# Altium schematic sheet Motor Drivers.SchDoc: Dual Feeder - Motor Drivers
size Letter; DrawnBy: Mark Harris; Engineer: Mark Harris; Organization: Mark Harris; ProjectName: Dual Feeder Controller
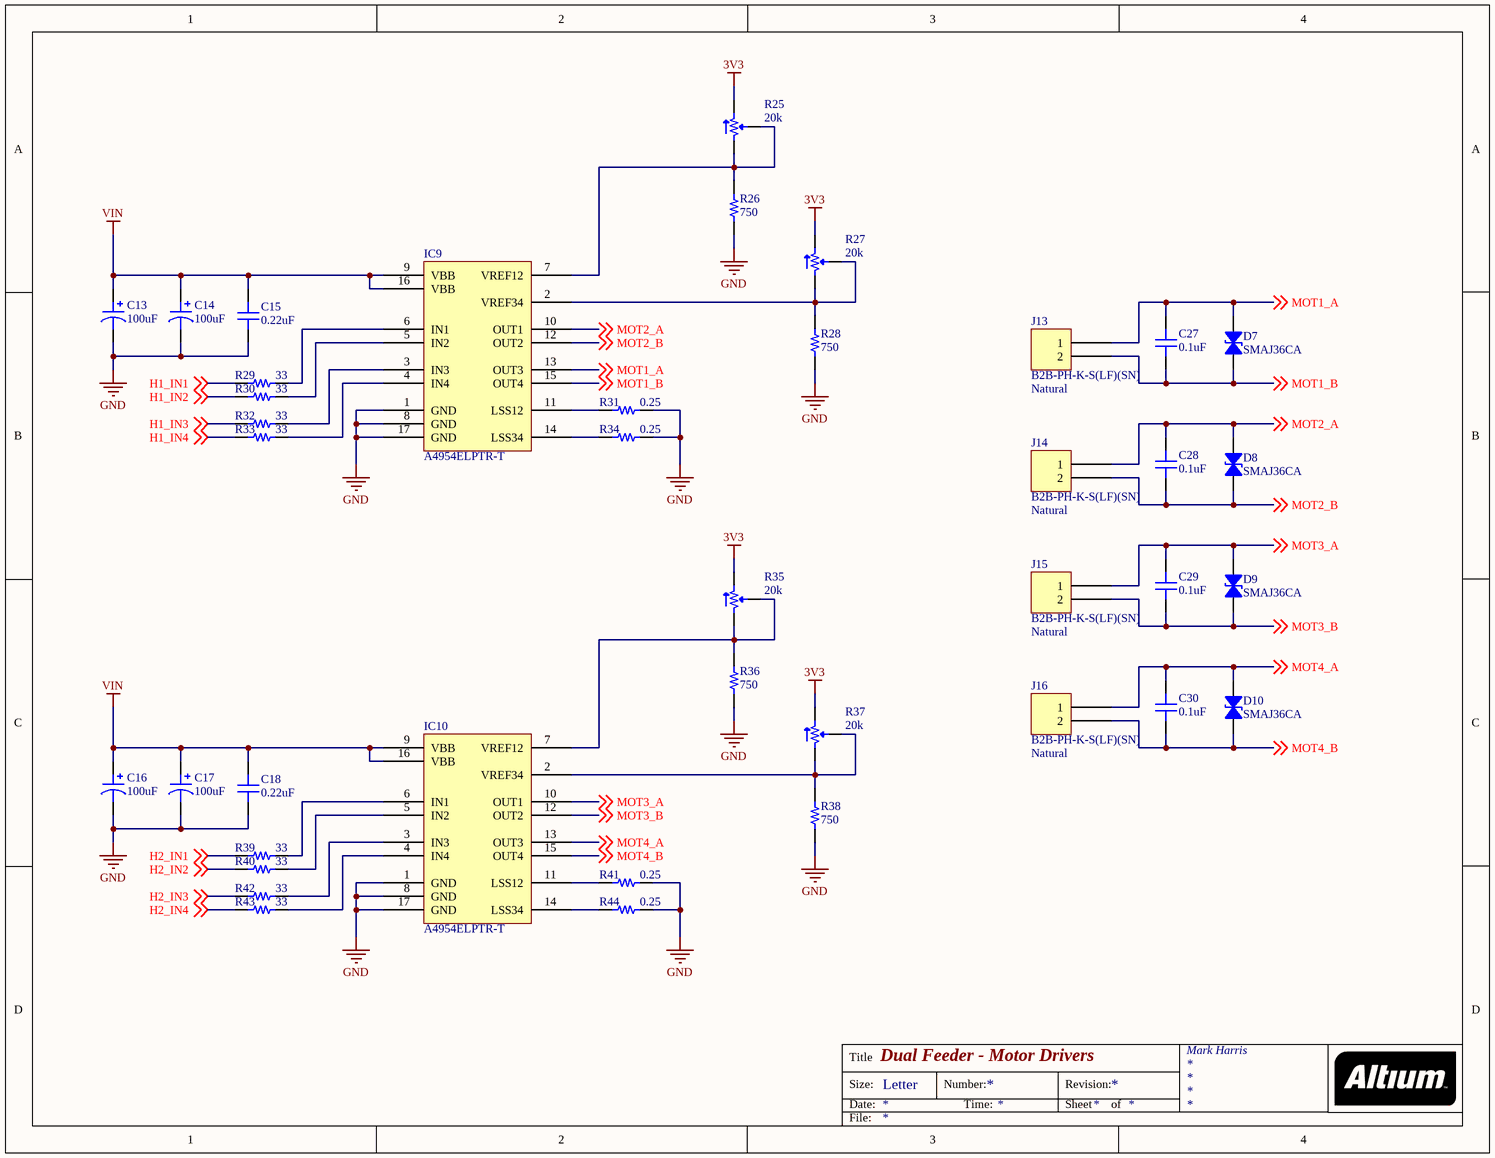
[diagram p0: Motor Drivers.SchDoc]

## Parts
C13  100uF  [CAP ALUM 8.3MM]
C14  100uF  [CAP ALUM 8.3MM]
C15  0.22uF  [CAP 0805/2012]
C16  100uF  [CAP ALUM 8.3MM]
C17  100uF  [CAP ALUM 8.3MM]
C18  0.22uF  [CAP 0805/2012]
C27  0.1uF  [CAP 0603/1608]
C28  0.1uF  [CAP 0603/1608]
C29  0.1uF  [CAP 0603/1608]
C30  0.1uF  [CAP 0603/1608]
D7  SMAJ36CA  [Bourns DO214AC SMA]
D8  SMAJ36CA  [Bourns DO214AC SMA]
D9  SMAJ36CA  [Bourns DO214AC SMA]
D10  SMAJ36CA  [Bourns DO214AC SMA]
IC9  A4954ELPTR-T  [ALLEGRO TSSOP-16EP LP]
IC10  A4954ELPTR-T  [ALLEGRO TSSOP-16EP LP]
J13  B2B-PH-K-S(LF)(SN)  Colour: Natural  [JST B2B-PH-K]
J14  B2B-PH-K-S(LF)(SN)  Colour: Natural  [JST B2B-PH-K]
J15  B2B-PH-K-S(LF)(SN)  Colour: Natural  [JST B2B-PH-K]
J16  B2B-PH-K-S(LF)(SN)  Colour: Natural  [JST B2B-PH-K]
R25  20k  [POT BOURNS TRIMPOT 3302]
R26  750  [RES 0603/1608]
R27  20k  [POT BOURNS TRIMPOT 3302]
R28  750  [RES 0603/1608]
R29  33  [RES 0603/1608]
R30  33  [RES 0603/1608]
R31  0.25  [STACKPOLE CSR1206]
R32  33  [RES 0603/1608]
R33  33  [RES 0603/1608]
R34  0.25  [STACKPOLE CSR1206]
R35  20k  [POT BOURNS TRIMPOT 3302]
R36  750  [RES 0603/1608]
R37  20k  [POT BOURNS TRIMPOT 3302]
R38  750  [RES 0603/1608]
R39  33  [RES 0603/1608]
R40  33  [RES 0603/1608]
R41  0.25  [STACKPOLE CSR1206]
R42  33  [RES 0603/1608]
R43  33  [RES 0603/1608]
R44  0.25  [STACKPOLE CSR1206]

## Nets
3V3: R25.3 R27.3 R35.3 R37.3
GND: C13.2 C14.2 C15.1 C16.2 C17.2 C18.1 IC9.1(GND) IC9.8(GND) IC9.17(GND) IC10.1(GND) IC10.8(GND) IC10.17(GND) R26.1 R28.1 R31.2 R34.2 R36.1 R38.1 R41.2 R44.2
VIN: C13.1 C14.1 C15.2 C16.1 C17.1 C18.2 IC9.9(VBB) IC9.16(VBB) IC10.9(VBB) IC10.16(VBB)
H1_IN1: R29.1 ; off-sheet H1_IN1
H1_IN2: R30.1 ; off-sheet H1_IN2
H1_IN3: R32.1 ; off-sheet H1_IN3
H1_IN4: R33.1 ; off-sheet H1_IN4
H2_IN1: R39.1 ; off-sheet H2_IN1
H2_IN2: R40.1 ; off-sheet H2_IN2
H2_IN3: R42.1 ; off-sheet H2_IN3
H2_IN4: R43.1 ; off-sheet H2_IN4
MOT1_A: C27.1 D7.2 IC9.13(OUT3) J13.1 ; off-sheet MOT1_A
MOT1_B: C27.2 D7.1 IC9.15(OUT4) J13.2 ; off-sheet MOT1_B
MOT2_A: C28.1 D8.2 IC9.10(OUT1) J14.1 ; off-sheet MOT2_A
MOT2_B: C28.2 D8.1 IC9.12(OUT2) J14.2 ; off-sheet MOT2_B
MOT3_A: C29.1 D9.2 IC10.10(OUT1) J15.1 ; off-sheet MOT3_A
MOT3_B: C29.2 D9.1 IC10.12(OUT2) J15.2 ; off-sheet MOT3_B
MOT4_A: C30.1 D10.2 IC10.13(OUT3) J16.1 ; off-sheet MOT4_A
MOT4_B: C30.2 D10.1 IC10.15(OUT4) J16.2 ; off-sheet MOT4_B
NetIC9_2: IC9.2(VREF34) R27.1 R27.2 R28.2
NetIC9_3: IC9.3(IN3) R32.2
NetIC9_4: IC9.4(IN4) R33.2
NetIC9_5: IC9.5(IN2) R30.2
NetIC9_6: IC9.6(IN1) R29.2
NetIC9_7: IC9.7(VREF12) R25.1 R25.2 R26.2
NetIC9_11: IC9.11(LSS12) R31.1
NetIC9_14: IC9.14(LSS34) R34.1
NetIC10_2: IC10.2(VREF34) R37.1 R37.2 R38.2
NetIC10_3: IC10.3(IN3) R42.2
NetIC10_4: IC10.4(IN4) R43.2
NetIC10_5: IC10.5(IN2) R40.2
NetIC10_6: IC10.6(IN1) R39.2
NetIC10_7: IC10.7(VREF12) R35.1 R35.2 R36.2
NetIC10_11: IC10.11(LSS12) R41.1
NetIC10_14: IC10.14(LSS34) R44.1

## Notes on the sheet
- Title
- Size:
- Date:
- Letter
- Number:
- Time:
- Revision:
- Sheet
- of
- File:

## Library data of the parts
C13 C14 C16 C17 = UWT1H101MNL1GS: CAP ALUM 100UF 20% 50V SMD; Manufacturer: Nichicon; TemperatureRange: -55C ~ 105C; Type: General Purpose; Ripple Current: 140mA; Lifetime @ Temp: 1000 Hrs @ 105C; Value: 100uF; Part Number: UWT1H101MNL1GS; PartId: 7285; Supplier 1: Digi-Key; Supplier Part Number 1: 493-2226-2-ND; ComponentLink1Description: Datasheet; ComponentLink1URL: http://nichicon-us.com/english/products/pdfs/e-wt.pdf; ComponentLink2Description: Digi-Key listing; ComponentLink2URL: http://digikey.com/product-detail/en/UWT1H101MNL1GS/493-2226-2-ND/589967; Tolerance: 20%; Voltage: 50V; Price: 0.2178; Device Package: Radial, Can - SMD; Impedance: -
C15 C18 = CL21B224KBFSFNE: CAP CER 0.22UF 50V X7R 0805; Manufacturer: Samsung Electro-Mechanics America, Inc.; TemperatureRange: -55C ~ 125C; Tolerance: 10%; Value: 0.22uF; Part Number: CL21B224KBFSFNE; PartId: 13765; Supplier 1: Digi-Key; Supplier Part Number 1: 1276-2948-2-ND; ComponentLink1Description: Datasheet; ComponentLink1URL: //media.digikey.com/pdf/Data%20Sheets/Samsung%20PDFs/CL21B224KBFSFNE_Spec.pdf; ComponentLink2Description: Digi-Key Listing; ComponentLink2URL: https://www.digikey.com/product-detail/en/samsung-electro-mechanics-america-inc/CL21B224KBFSFNE/1276-2948-2-ND/3888606; TemperatureCoefficient: X7R; Voltage: 50V; Price: 0.0195; Device Package: 0805 (2012 Metric)
C27-C30 = CL10B104JB8NNNC: CAP CER 0.1UF 50V X7R 0603; Manufacturer: Samsung Electro-Mechanics America, Inc.; TemperatureRange: -55C ~ 125C; Tolerance: 5%; Value: 0.1uF; Part Number: CL10B104JB8NNNC; PartId: 5416; Supplier 1: Digi-Key; Supplier Part Number 1: 1276-1033-2-ND; ComponentLink1Description: Datasheet; ComponentLink1URL: http://www.samsungsem.com/kr/support/product-search/mlcc/CL10B104JB8NNNC.jsp; ComponentLink2Description: Digi-Key listing; ComponentLink2URL: http://digikey.com/product-detail/en/CL10B104JB8NNNC/1276-1033-2-ND/3886691; TemperatureCoefficient: X7R; Voltage: 50V; Price: 0.0132; Type: -; Device Package: 0603 (1608 Metric)
D7-D10 = SMAJ36CA: TVS DIODE 36VWM 58.1VC DO214AC; Manufacturer: Bourns Inc.; Type: Zener; Bidirectional Channels: 1; Power - Peak Pulse: 400W; Current - Peak Pulse: 6.9A; Voltage (Clamping): 58.1V; Voltage (Breakdown): 40V; Voltage (Reverse Standoff): 36V; Part Number: SMAJ36CA; PartId: 14838; Supplier 1: Digi-Key; Supplier Part Number 1: SMAJ36CABTR-ND; ComponentLink1Description: Datasheet; ComponentLink1URL: http://www.bourns.com/docs/Product-Datasheets/SMAJ.pdf; ComponentLink2Description: Digi-Key Listing; ComponentLink2URL: https://www.digikey.com/product-detail/en/bourns-inc/SMAJ36CA/SMAJ36CABTR-ND/2254607; Operating Temperature: -55C ~ 150C (TJ); Price: 0.0992; Device Package: DO-214AC, SMA
IC9 IC10 = A4954ELPTR-T: IC MOTOR DRIVER PAR 16TSSOP; Manufacturer: Allegro MicroSystems, LLC; Motor Type - AC, DC: Brushed DC; Function: Driver - Fully Integrated, Control and Power Stage; Output Configuration: Half Bridge (4); Interface: Parallel; Current - Output: 2A; Voltage - Supply: 8 V ~ 40 V; Part Number: A4954ELPTR-T; PartId: 27911; Supplier 1: Digi-Key; Supplier Part Number 1: 620-1384-1-ND; ComponentLink1Description: Datasheet; ComponentLink1URL: http://www.allegromicro.com/~/media/Files/Datasheets/A4954-Datasheet.ashx; ComponentLink2Description: Digi-Key Listing; ComponentLink2URL: http://www.digikey.com/product-detail/en/allegro-microsystems-llc/A4954ELPTR-T/620-1384-1-ND/2509924; Price: 2.84; Device Package: 16-TSSOP (0.173", 4.40mm Width) Exposed Pad; Motor Type - Stepper: -; Technology: DMOS; Step Resolution: -; Voltage - Load: 8 V ~ 40 V
J13-J16 = B2B-PH-K-S(LF)(SN): CONN HEADER PH TOP 2POS 2MM; Manufacturer: JST Sales America Inc.; Pitch: 0.079" (2.00mm); Number Of Positions: 2; Part Number: B2B-PH-K-S(LF)(SN); PartId: 29447; Supplier 1: Digi-Key; Supplier Part Number 1: 455-1704-ND; ComponentLink1Description: Datasheet; ComponentLink1URL: http://www.jst-mfg.com/product/pdf/eng/ePH.pdf; ComponentLink2Description: Digi-Key Listing; ComponentLink2URL: http://www.digikey.com/product-detail/en/jst-sales-america-inc/B2B-PH-K-S(LF)(SN)/455-1704-ND/926611; Price: 0.17; Type: Header, Shrouded; Contact Finish: Tin; Fastening Type: Detent Lock; Number Of Rows: 1; Series: PH
R25 R27 R35 R37 = 3302W-3-203E: TRIMMER 20K OHM 0.15W SMD; Manufacturer: Bourns Inc.; TemperatureCoefficient: 250ppm/C; Tolerance: 25%; Number Of Turns: 1; Adjustment Type: Top Adjustment; Value: 20k; Part Number: 3302W-3-203E; PartId: 29442; Supplier 1: Digi-Key; Supplier Part Number 1: 3302W-203ECT-ND; ComponentLink1Description: Datasheet; ComponentLink1URL: http://www.bourns.com/docs/Product-Datasheets/3302.pdf; ComponentLink2Description: Digi-Key Listing; ComponentLink2URL: https://www.digikey.com/product-detail/en/bourns-inc/3302W-3-203E/3302W-203ECT-ND/612878; PowerRating: 0.15W; Price: 0.97
R26 R28 R36 R38 = ERJ-3EKF7500V: RES SMD 750 OHM 1% 1/10W 0603; Manufacturer: Panasonic Electronic Components; TemperatureRange: -55C ~ 155C; TemperatureCoefficient: 100ppm/C; PowerRating: 0.1W, 1/10W; Value: 750; Part Number: ERJ-3EKF7500V; PartId: 921; Supplier 1: Digi-Key; Supplier Part Number 1: P750HTR-ND; ComponentLink1Description: Datasheet; ComponentLink1URL: http://industrial.panasonic.com/www-cgi/jvcr13pz.cgi?E+PZ+3+AOA0002+ERJ3EKF7500V+7+WW; ComponentLink2Description: Digi-Key listing; ComponentLink2URL: http://digikey.com/product-detail/en/ERJ-3EKF7500V/P750HTR-ND/196472; Tolerance: 1%; Price: 0.0038; Type: Thick Film; Device Package: 0603 (1608 Metric)
R29 R30 R32 R33 R39 R40 R42 R43 = ERJ-3EKF33R0V: RES SMD 33 OHM 1% 1/10W 0603; Manufacturer: Panasonic Electronic Components; TemperatureRange: -55C ~ 155C; TemperatureCoefficient: 100ppm/C; PowerRating: 0.1W, 1/10W; Value: 33; Part Number: ERJ-3EKF33R0V; PartId: 901; Supplier 1: Digi-Key; Supplier Part Number 1: P33.0HTR-ND; ComponentLink1Description: Datasheet; ComponentLink1URL: http://industrial.panasonic.com/www-cgi/jvcr13pz.cgi?E+PZ+3+AOA0002+ERJ3EKF33R0V+7+WW; ComponentLink2Description: Digi-Key listing; ComponentLink2URL: http://digikey.com/product-detail/en/ERJ-3EKF33R0V/P33.0HTR-ND/1746383; Tolerance: 1%; Price: 0.0038; Type: Thick Film; Device Package: 0603 (1608 Metric)
R31 R34 R41 R44 = CSR1206FKR250: RES SMD 0.25 OHM 1% 1/2W 1206; Manufacturer: Stackpole Electronics Inc.; TemperatureRange: -55C ~ 155C; TemperatureCoefficient: 100ppm/C; PowerRating: 0.5W, 1/2W; Value: 0.25; Part Number: CSR1206FKR250; PartId: 9967; Supplier 1: Digi-Key; Supplier Part Number 1: CSR1206FKR250TR-ND; ComponentLink1Description: Datasheet; ComponentLink1URL: http://www.seielect.com/catalog/SEI-CSR_CSRN.pdf; ComponentLink2Description: Digi-Key Listing; ComponentLink2URL: https://www.digikey.com/product-detail/en/stackpole-electronics-inc/CSR1206FKR250/CSR1206FKR250TR-ND/1788086; Tolerance: 1%; Price: 0.072; Device Package: 1206 (3216 Metric)